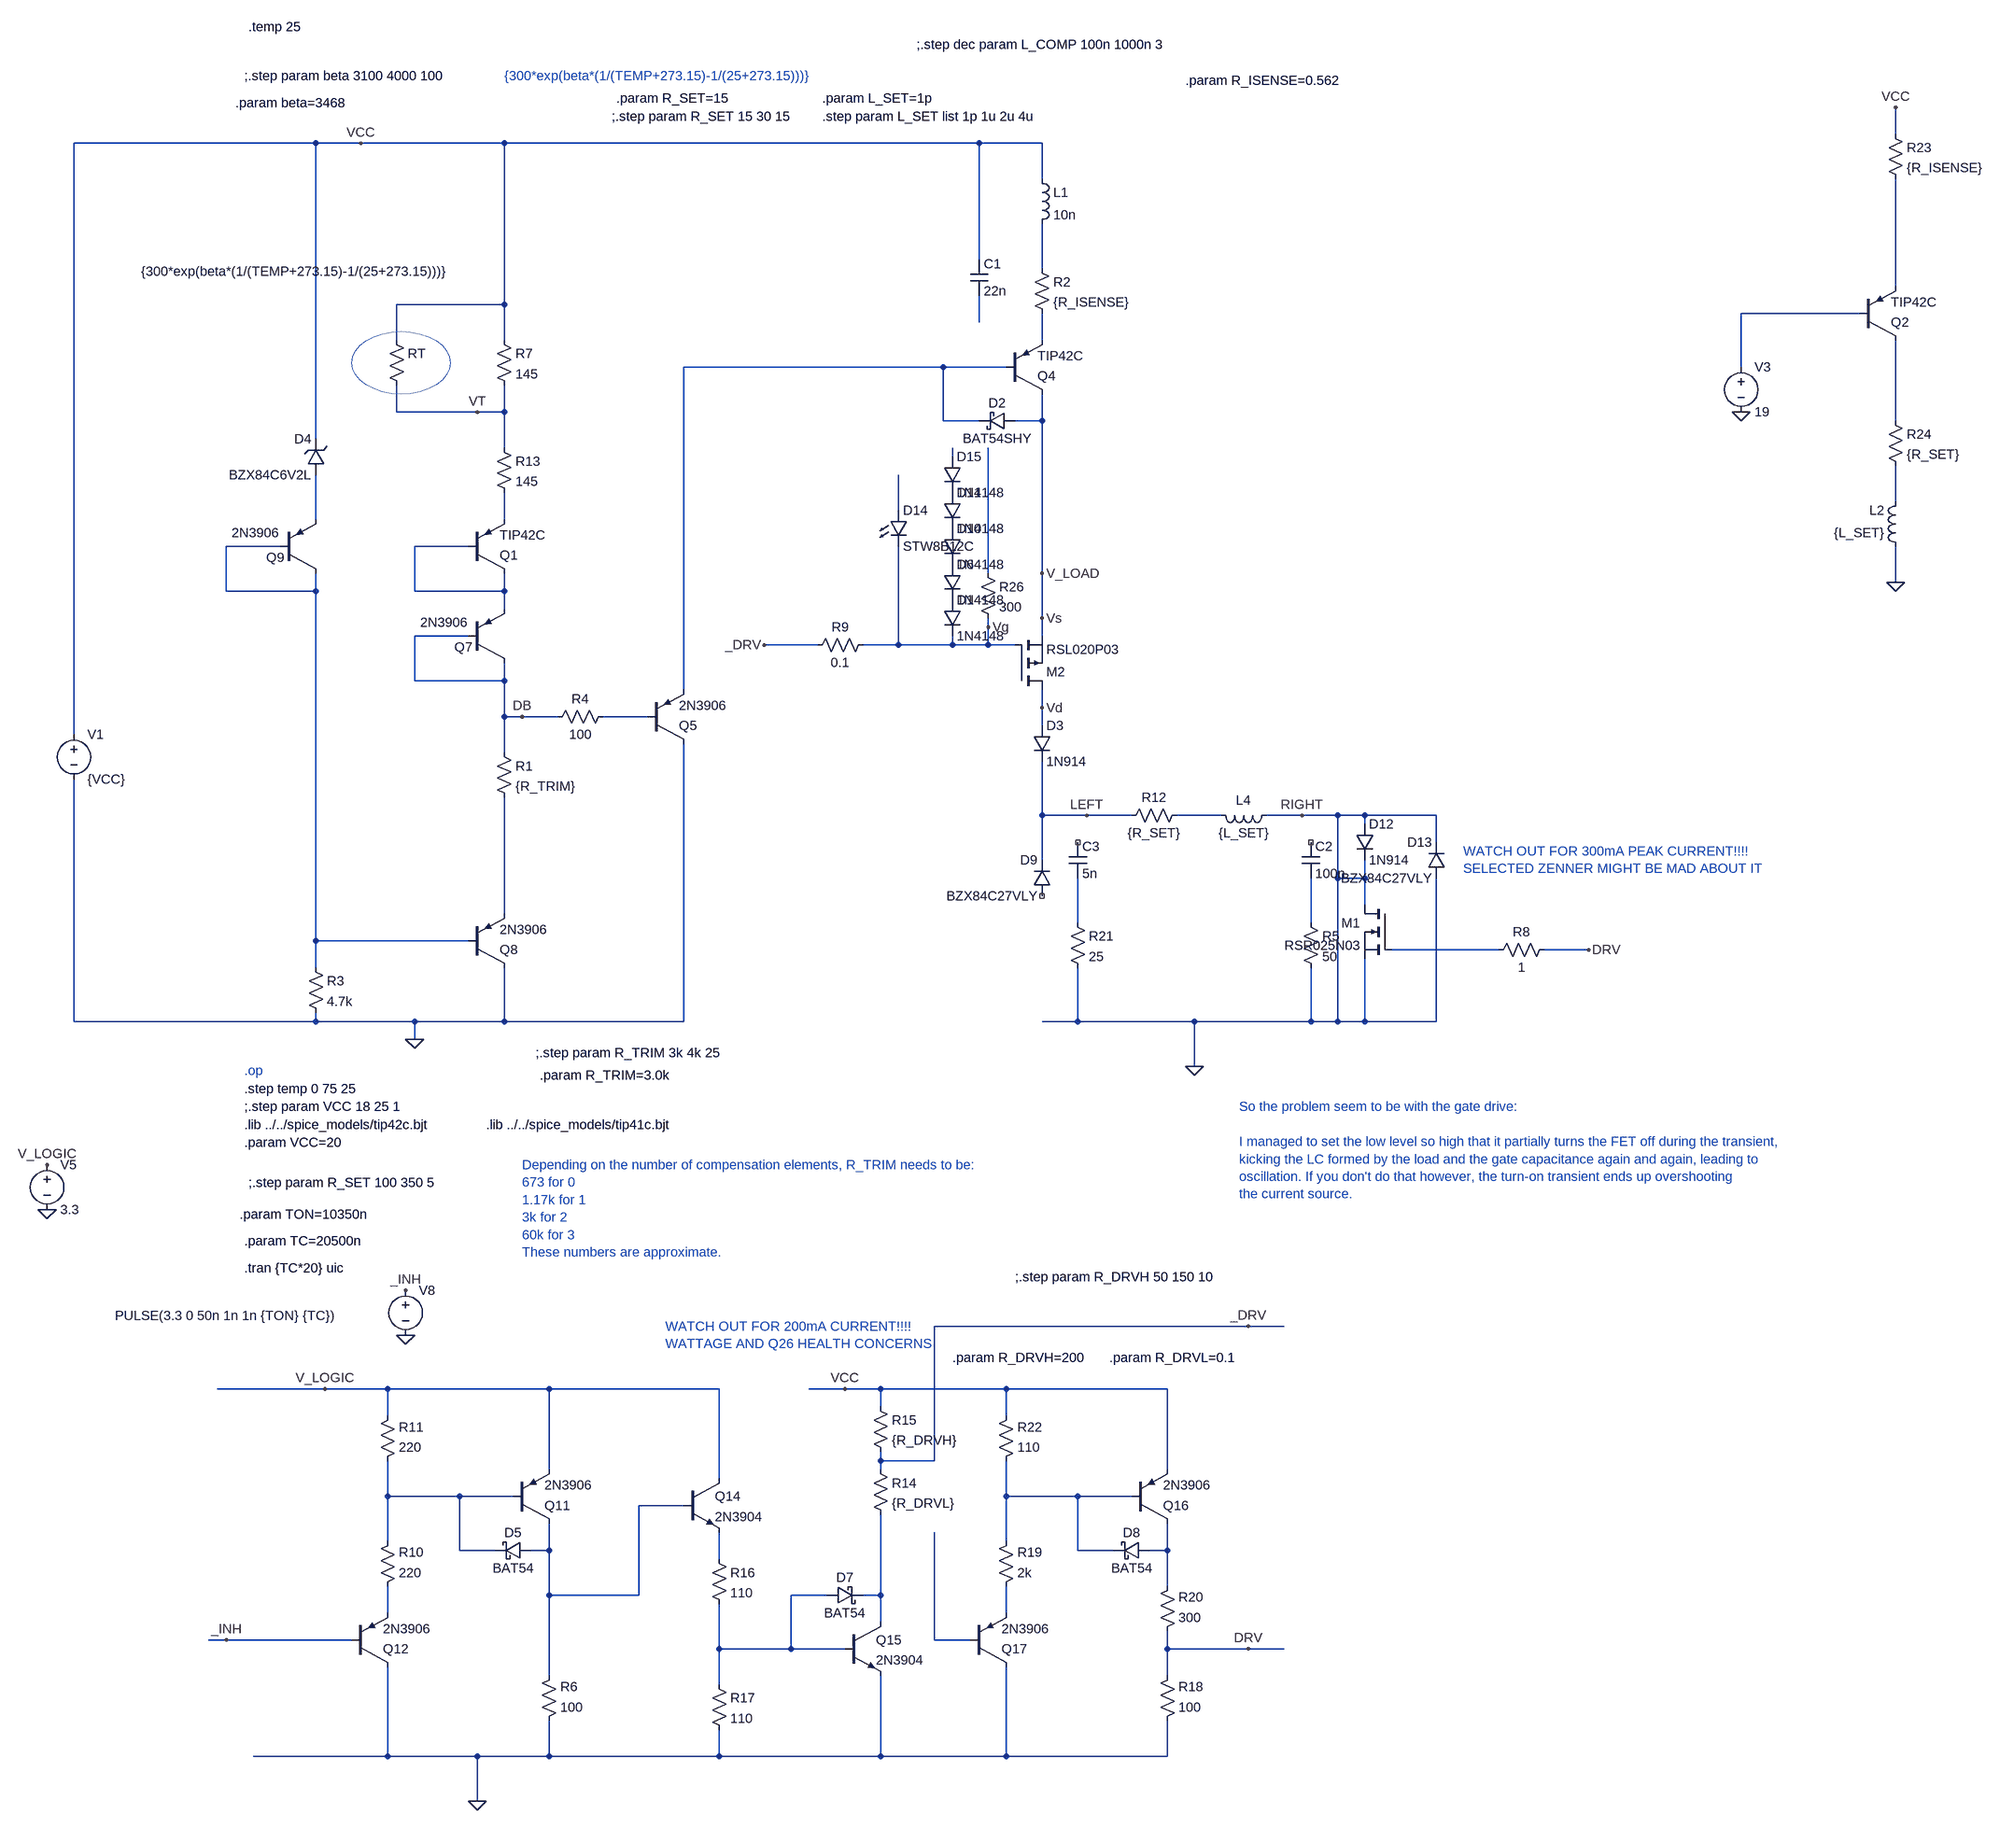
[diagram p0: schematic sense_inhibit4.asc]
sense_inhibit4.asc, the LTspice schematic file:
Version 4
SHEET 1 4220 5156
WIRE 352 -1568 352 -1616
WIRE -2496 -1552 -2928 -1552
WIRE -2416 -1552 -2496 -1552
WIRE -2160 -1552 -2416 -1552
WIRE -1312 -1552 -2160 -1552
WIRE -1200 -1552 -1312 -1552
WIRE -1200 -1488 -1200 -1552
WIRE -1312 -1344 -1312 -1552
WIRE -1200 -1328 -1200 -1408
WIRE 352 -1296 352 -1488
WIRE -2160 -1264 -2160 -1552
WIRE -2160 -1264 -2352 -1264
WIRE 288 -1248 48 -1248
WIRE -1312 -1232 -1312 -1280
WIRE -2352 -1200 -2352 -1264
WIRE -2160 -1200 -2160 -1264
WIRE -1200 -1200 -1200 -1248
WIRE -1376 -1152 -1840 -1152
WIRE -1264 -1152 -1376 -1152
WIRE 48 -1152 48 -1248
WIRE -2352 -1072 -2352 -1120
WIRE -2208 -1072 -2352 -1072
WIRE -2160 -1072 -2160 -1120
WIRE -2160 -1072 -2208 -1072
WIRE -1376 -1056 -1376 -1152
WIRE -1312 -1056 -1376 -1056
WIRE -1200 -1056 -1200 -1104
WIRE -1200 -1056 -1248 -1056
WIRE 352 -1056 352 -1200
WIRE -2496 -1024 -2496 -1552
WIRE -2160 -1008 -2160 -1072
WIRE -1360 -992 -1360 -1008
WIRE 352 -912 352 -976
WIRE -1456 -896 -1456 -960
WIRE -2496 -880 -2496 -960
WIRE -2160 -880 -2160 -928
WIRE -2560 -832 -2656 -832
WIRE -2224 -832 -2320 -832
WIRE -1296 -784 -1296 -1008
WIRE -1200 -784 -1200 -1056
WIRE 352 -768 352 -832
WIRE -2656 -752 -2656 -832
WIRE -2496 -752 -2496 -784
WIRE -2496 -752 -2656 -752
WIRE -2320 -752 -2320 -832
WIRE -2160 -752 -2160 -784
WIRE -2160 -752 -2320 -752
WIRE -2160 -720 -2160 -752
WIRE -1200 -704 -1200 -784
WIRE -1296 -688 -1296 -704
WIRE -2224 -672 -2320 -672
WIRE -1200 -672 -1200 -704
WIRE -1600 -656 -1696 -656
WIRE -1456 -656 -1456 -832
WIRE -1456 -656 -1520 -656
WIRE -1360 -656 -1360 -672
WIRE -1360 -656 -1456 -656
WIRE -1296 -656 -1296 -688
WIRE -1296 -656 -1360 -656
WIRE -1248 -656 -1296 -656
WIRE -2320 -592 -2320 -672
WIRE -2160 -592 -2160 -624
WIRE -2160 -592 -2320 -592
WIRE -1840 -576 -1840 -1152
WIRE -1200 -544 -1200 -576
WIRE -2160 -528 -2160 -592
WIRE -2128 -528 -2160 -528
WIRE -2064 -528 -2128 -528
WIRE -1904 -528 -1984 -528
WIRE -1200 -512 -1200 -544
WIRE -2928 -496 -2928 -1552
WIRE -2160 -464 -2160 -528
WIRE -1200 -352 -1200 -448
WIRE -1120 -352 -1200 -352
WIRE -1040 -352 -1120 -352
WIRE -880 -352 -960 -352
WIRE -736 -352 -800 -352
WIRE -672 -352 -736 -352
WIRE -624 -352 -672 -352
WIRE -496 -352 -624 -352
WIRE -624 -336 -624 -352
WIRE -496 -304 -496 -352
WIRE -1200 -272 -1200 -352
WIRE -672 -240 -672 -352
WIRE -624 -240 -624 -272
WIRE -624 -240 -672 -240
WIRE -624 -192 -624 -240
WIRE -2160 -176 -2160 -384
WIRE -1136 -160 -1136 -240
WIRE -720 -160 -720 -240
WIRE -2496 -128 -2496 -752
WIRE -2224 -128 -2496 -128
WIRE -384 -112 -576 -112
WIRE -224 -112 -304 -112
WIRE -2496 -80 -2496 -128
WIRE -2928 16 -2928 -416
WIRE -2496 16 -2496 0
WIRE -2496 16 -2928 16
WIRE -2320 16 -2496 16
WIRE -2160 16 -2160 -80
WIRE -2160 16 -2320 16
WIRE -1840 16 -1840 -480
WIRE -1840 16 -2160 16
WIRE -1136 16 -1136 -80
WIRE -1136 16 -1200 16
WIRE -928 16 -1136 16
WIRE -720 16 -720 -80
WIRE -720 16 -928 16
WIRE -672 16 -672 -240
WIRE -672 16 -720 16
WIRE -624 16 -624 -96
WIRE -624 16 -672 16
WIRE -496 16 -496 -240
WIRE -496 16 -624 16
WIRE -2320 48 -2320 16
WIRE -928 96 -928 16
WIRE -832 560 -1392 560
WIRE -768 560 -832 560
WIRE -2480 672 -2672 672
WIRE -2368 672 -2480 672
WIRE -2080 672 -2368 672
WIRE -1776 672 -2080 672
WIRE -1552 672 -1616 672
WIRE -1488 672 -1552 672
WIRE -1264 672 -1488 672
WIRE -976 672 -1264 672
WIRE -1488 704 -1488 672
WIRE -2368 720 -2368 672
WIRE -1264 720 -1264 672
WIRE -1488 800 -1488 784
WIRE -1392 800 -1392 560
WIRE -1392 800 -1488 800
WIRE -2080 816 -2080 672
WIRE -1488 816 -1488 800
WIRE -976 816 -976 672
WIRE -1776 832 -1776 672
WIRE -2368 864 -2368 800
WIRE -2240 864 -2368 864
WIRE -2144 864 -2240 864
WIRE -1264 864 -1264 800
WIRE -1136 864 -1264 864
WIRE -1040 864 -1136 864
WIRE -1840 880 -1920 880
WIRE -2368 944 -2368 864
WIRE -1264 944 -1264 864
WIRE -2240 960 -2240 864
WIRE -2176 960 -2240 960
WIRE -2080 960 -2080 912
WIRE -2080 960 -2112 960
WIRE -1136 960 -1136 864
WIRE -1072 960 -1136 960
WIRE -976 960 -976 912
WIRE -976 960 -1008 960
WIRE -1776 976 -1776 928
WIRE -976 1024 -976 960
WIRE -2080 1040 -2080 960
WIRE -1920 1040 -1920 880
WIRE -1920 1040 -2080 1040
WIRE -1584 1040 -1648 1040
WIRE -1488 1040 -1488 896
WIRE -1488 1040 -1520 1040
WIRE -2368 1072 -2368 1024
WIRE -1264 1072 -1264 1024
WIRE -1488 1088 -1488 1040
WIRE -2656 1120 -2688 1120
WIRE -2432 1120 -2656 1120
WIRE -1392 1120 -1392 928
WIRE -1328 1120 -1392 1120
WIRE -1776 1136 -1776 1056
WIRE -1648 1136 -1648 1040
WIRE -1648 1136 -1776 1136
WIRE -1552 1136 -1648 1136
WIRE -976 1136 -976 1104
WIRE -832 1136 -976 1136
WIRE -768 1136 -832 1136
WIRE -2080 1184 -2080 1040
WIRE -976 1184 -976 1136
WIRE -1776 1200 -1776 1136
WIRE -2368 1328 -2368 1168
WIRE -2368 1328 -2608 1328
WIRE -2208 1328 -2368 1328
WIRE -2080 1328 -2080 1264
WIRE -2080 1328 -2208 1328
WIRE -1776 1328 -1776 1280
WIRE -1776 1328 -2080 1328
WIRE -1488 1328 -1488 1184
WIRE -1488 1328 -1776 1328
WIRE -1264 1328 -1264 1168
WIRE -1264 1328 -1488 1328
WIRE -976 1328 -976 1264
WIRE -976 1328 -1264 1328
WIRE -2208 1408 -2208 1328
FLAG -2320 48 0
FLAG -2208 -1072 VT
FLAG -2416 -1552 VCC
FLAG -2128 -528 DB
FLAG -928 96 0
FLAG -2976 352 0
FLAG -2976 272 V_LOGIC
FLAG -2336 496 _INH
FLAG -2336 576 0
FLAG -1696 -656 _DRV
FLAG -1120 -352 LEFT
FLAG -736 -352 RIGHT
FLAG -1200 -784 V_LOAD
FLAG -2656 1120 _INH
FLAG -2480 672 V_LOGIC
FLAG -1552 672 VCC
FLAG -2208 1408 0
FLAG -832 560 _DRV
FLAG -832 1136 DRV
FLAG -224 -112 DRV
FLAG 352 -768 0
FLAG 48 -1072 0
FLAG 352 -1616 VCC
FLAG -1200 -544 Vd
FLAG -1296 -688 Vg
FLAG -1200 -704 Vs
SYMBOL res -2176 -480 R0
SYMATTR InstName R1
SYMATTR Value {R_TRIM}
SYMBOL res -1216 -1344 R0
SYMATTR InstName R2
SYMATTR Value {R_ISENSE}
SYMBOL voltage -2928 -512 R0
SYMATTR InstName V1
SYMATTR Value {VCC}
SYMBOL pnp -1264 -1104 M180
SYMATTR InstName Q4
SYMATTR Value TIP42C
SYMBOL pnp -1904 -480 M180
SYMATTR InstName Q5
SYMATTR Value 2N3906
SYMBOL pnp -2224 -624 M180
WINDOW 0 -25 28 Left 2
WINDOW 3 -86 72 Left 2
SYMATTR InstName Q7
SYMATTR Value 2N3906
SYMBOL res -2176 -1216 R0
SYMATTR InstName R7
SYMATTR Value 145
SYMBOL res -2176 -1024 R0
SYMATTR InstName R13
SYMATTR Value 145
SYMBOL res -2368 -1216 R0
WINDOW 3 -440 -107 Left 2
SYMATTR Value {300*exp(beta*(1/(TEMP+273.15)-1/(25+273.15)))}
SYMATTR InstName RT
SYMBOL schottky -1248 -1072 R90
WINDOW 0 0 32 VBottom 2
WINDOW 3 32 32 VTop 2
SYMATTR InstName D2
SYMATTR Value BAT54SHY
SYMATTR Description Diode
SYMATTR Type diode
SYMBOL res -1056 -336 R270
WINDOW 0 32 56 VTop 2
WINDOW 3 0 56 VBottom 2
SYMATTR InstName R12
SYMATTR Value {R_SET}
SYMBOL ind -784 -368 R90
WINDOW 0 5 56 VBottom 2
WINDOW 3 32 56 VTop 2
SYMATTR InstName L4
SYMATTR Value {L_SET}
SYMBOL voltage -2976 256 R0
SYMATTR InstName V5
SYMATTR Value 3.3
SYMBOL voltage -2336 480 R0
WINDOW 123 0 0 Left 0
WINDOW 39 0 0 Left 0
WINDOW 3 -519 61 Left 2
SYMATTR Value PULSE(3.3 0 50n 1n 1n {TON} {TC})
SYMATTR InstName V8
SYMBOL pmos -1248 -576 M180
SYMATTR InstName M2
SYMATTR Value RSL020P03
SYMBOL cap -1328 -1344 R0
SYMATTR InstName C1
SYMATTR Value 22n
SYMBOL diode -1216 -512 R0
SYMATTR InstName D3
SYMATTR Value 1N914
SYMBOL diode -1184 -208 R180
WINDOW 0 24 64 Left 2
WINDOW 3 24 0 Left 2
SYMATTR InstName D9
SYMATTR Value BZX84C27VLY
SYMBOL schottky -2112 976 M270
WINDOW 0 32 32 VTop 2
WINDOW 3 0 32 VBottom 2
SYMATTR InstName D5
SYMATTR Value BAT54
SYMATTR Description Diode
SYMATTR Type diode
SYMBOL res -2096 1280 M180
WINDOW 0 36 76 Left 2
WINDOW 3 36 40 Left 2
SYMATTR InstName R6
SYMATTR Value 100
SYMBOL res -2384 1040 M180
WINDOW 0 36 76 Left 2
WINDOW 3 36 40 Left 2
SYMATTR InstName R10
SYMATTR Value 220
SYMBOL res -2384 816 M180
WINDOW 0 36 76 Left 2
WINDOW 3 36 40 Left 2
SYMATTR InstName R11
SYMATTR Value 220
SYMBOL pnp -2144 912 M180
SYMATTR InstName Q11
SYMATTR Value 2N3906
SYMBOL pnp -2432 1168 M180
SYMATTR InstName Q12
SYMATTR Value 2N3906
SYMBOL schottky -1584 1024 M90
WINDOW 0 0 32 VBottom 2
WINDOW 3 32 32 VTop 2
SYMATTR InstName D7
SYMATTR Value BAT54
SYMATTR Description Diode
SYMATTR Type diode
SYMBOL res -1504 688 R0
SYMATTR InstName R15
SYMATTR Value {R_DRVH}
SYMBOL res -1792 960 R0
SYMATTR InstName R16
SYMATTR Value 110
SYMBOL res -1792 1184 R0
SYMATTR InstName R17
SYMATTR Value 110
SYMBOL npn -1840 832 R0
SYMATTR InstName Q14
SYMATTR Value 2N3904
SYMBOL npn -1552 1088 R0
SYMATTR InstName Q15
SYMATTR Value 2N3904
SYMBOL schottky -1008 976 M270
WINDOW 0 32 32 VTop 2
WINDOW 3 0 32 VBottom 2
SYMATTR InstName D8
SYMATTR Value BAT54
SYMATTR Description Diode
SYMATTR Type diode
SYMBOL res -992 1280 M180
WINDOW 0 36 76 Left 2
WINDOW 3 36 40 Left 2
SYMATTR InstName R18
SYMATTR Value 100
SYMBOL res -1280 1040 M180
WINDOW 0 36 76 Left 2
WINDOW 3 36 40 Left 2
SYMATTR InstName R19
SYMATTR Value 2k
SYMBOL res -1280 816 M180
WINDOW 0 36 76 Left 2
WINDOW 3 36 40 Left 2
SYMATTR InstName R22
SYMATTR Value 110
SYMBOL pnp -1040 912 M180
SYMATTR InstName Q16
SYMATTR Value 2N3906
SYMBOL pnp -1328 1168 M180
SYMATTR InstName Q17
SYMATTR Value 2N3906
SYMBOL nmos -576 -192 M0
SYMATTR InstName M1
SYMATTR Value RSR025N03
SYMBOL diode -640 -336 R0
SYMATTR InstName D12
SYMATTR Value 1N914
SYMBOL diode -480 -240 R180
WINDOW 0 24 64 Left 2
WINDOW 3 24 0 Left 2
SYMATTR InstName D13
SYMATTR Value BZX84C27VLY
SYMBOL zener -2480 -960 R180
WINDOW 0 24 64 Left 2
WINDOW 3 24 0 Left 2
SYMATTR InstName D4
SYMATTR Value BZX84C6V2L
SYMBOL res -2512 -96 R0
SYMATTR InstName R3
SYMATTR Value 4.7k
SYMBOL pnp -2224 -80 M180
SYMATTR InstName Q8
SYMATTR Value 2N3906
SYMBOL pnp -2560 -784 M180
WINDOW 0 -25 28 Left 2
WINDOW 3 -86 72 Left 2
SYMATTR InstName Q9
SYMATTR Value 2N3906
SYMBOL res -1968 -544 R90
WINDOW 0 0 56 VBottom 2
WINDOW 3 32 56 VTop 2
SYMATTR InstName R4
SYMATTR Value 100
SYMBOL pnp -2224 -784 M180
SYMATTR InstName Q1
SYMATTR Value TIP42C
SYMBOL res -288 -128 R90
WINDOW 0 0 56 VBottom 2
WINDOW 3 32 56 VTop 2
SYMATTR InstName R8
SYMATTR Value 1
SYMBOL res -1504 -672 R90
WINDOW 0 0 56 VBottom 2
WINDOW 3 32 56 VTop 2
SYMATTR InstName R9
SYMATTR Value 0.1
SYMBOL res -1504 800 R0
SYMATTR InstName R14
SYMATTR Value {R_DRVL}
SYMBOL res -992 1120 M180
WINDOW 0 36 76 Left 2
WINDOW 3 36 40 Left 2
SYMATTR InstName R20
SYMATTR Value 300
SYMBOL cap -1152 -304 R0
SYMATTR InstName C3
SYMATTR Value 5n
SYMBOL res -1152 -176 R0
SYMATTR InstName R21
SYMATTR Value 25
SYMBOL cap -736 -304 R0
SYMATTR InstName C2
SYMATTR Value 100n
SYMBOL res -736 -176 R0
SYMATTR InstName R5
SYMATTR Value 50
SYMBOL res 336 -1584 R0
SYMATTR InstName R23
SYMATTR Value {R_ISENSE}
SYMBOL pnp 288 -1200 M180
SYMATTR InstName Q2
SYMATTR Value TIP42C
SYMBOL res 336 -1072 R0
SYMATTR InstName R24
SYMATTR Value {R_SET}
SYMBOL ind 368 -816 R180
WINDOW 0 36 80 Left 2
WINDOW 3 36 40 Left 2
SYMATTR InstName L2
SYMATTR Value {L_SET}
SYMBOL voltage 48 -1168 R0
SYMATTR InstName V3
SYMATTR Value 19
SYMBOL res -1312 -800 R0
SYMATTR InstName R26
SYMATTR Value 300
SYMBOL diode -1376 -736 R0
SYMATTR InstName D1
SYMATTR Value 1N4148
SYMATTR Description Zener Diode
SYMATTR Type zener
SYMBOL diode -1376 -800 R0
SYMATTR InstName D6
SYMATTR Value 1N4148
SYMATTR Description Zener Diode
SYMATTR Type zener
SYMBOL diode -1376 -864 R0
SYMATTR InstName D10
SYMATTR Value 1N4148
SYMATTR Description Zener Diode
SYMATTR Type zener
SYMBOL diode -1376 -928 R0
SYMATTR InstName D11
SYMATTR Value 1N4148
SYMATTR Description Zener Diode
SYMATTR Type zener
SYMBOL LED -1472 -896 R0
SYMATTR InstName D14
SYMATTR Value STW8B12C
SYMATTR Description Zener Diode
SYMATTR Type zener
SYMBOL ind -1216 -1504 R0
SYMATTR InstName L1
SYMATTR Value 10n
SYMBOL diode -1376 -992 R0
SYMATTR InstName D15
SYMATTR Value 1N4148
SYMATTR Description Zener Diode
SYMATTR Type zener
TEXT -2624 456 Left 2 !.tran {TC*20} uic
TEXT -2624 136 Left 2 !.step temp 0 75 25
TEXT -2624 104 Left 2 ;.op
TEXT -2624 168 Left 2 !;.step param VCC 18 25 1
TEXT -2624 200 Left 2 !.lib ../../spice_models/tip42c.bjt
TEXT -2624 232 Left 2 !.param VCC=20
TEXT -2616 304 Left 2 !;.step param R_SET 100 350 5
TEXT -2640 -1624 Left 2 !.param beta=3468
TEXT -2624 -1672 Left 2 !;.step param beta 3100 4000 100
TEXT -2160 -1672 Left 2 ;{300*exp(beta*(1/(TEMP+273.15)-1/(25+273.15)))}
TEXT -1968 -1600 Left 2 !;.step param R_SET 15 30 15
TEXT -2616 -1760 Left 2 !.temp 25
TEXT -1592 -1600 Left 2 !.step param L_SET list 1p 1u 2u 4u
TEXT -2192 200 Left 2 !.lib ../../spice_models/tip41c.bjt
TEXT -1592 -1632 Left 2 !.param L_SET=1p
TEXT -1960 -1632 Left 2 !.param R_SET=15
TEXT -2632 360 Left 2 !.param TON=10350n
TEXT -2624 408 Left 2 !.param TC=20500n
TEXT -944 -1664 Left 2 !.param R_ISENSE=0.562
TEXT -1872 560 Left 2 ;WATCH OUT FOR 200mA CURRENT!!!!\nWATTAGE AND Q26 HEALTH CONCERNS
TEXT -448 -288 Left 2 ;WATCH OUT FOR 300mA PEAK CURRENT!!!!\nSELECTED ZENNER MIGHT BE MAD ABOUT IT
TEXT -1424 -1728 Left 2 !;.step dec param L_COMP 100n 1000n 3
TEXT -2104 72 Left 2 !;.step param R_TRIM 3k 4k 25
TEXT -2096 112 Left 2 !.param R_TRIM=3.0k
TEXT -2128 272 Left 2 ;Depending on the number of compensation elements, R_TRIM needs to be:\n673 for 0\n1.17k for 1\n3k for 2\n60k for 3\nThese numbers are approximate.
TEXT -1360 616 Left 2 !.param R_DRVH=200
TEXT -1080 616 Left 2 !.param R_DRVL=0.1
TEXT -1248 472 Left 2 !;.step param R_DRVH 50 150 10
TEXT -848 168 Left 2 ;So the problem seem to be with the gate drive:\n \nI managed to set the low level so high that it partially turns the FET off during the transient,\nkicking the LC formed by the load and the gate capacitance again and again, leading to\noscillation. If you don't do that however, the turn-on transient ends up overshooting\nthe current source.
CIRCLE Normal -2256 -1104 -2432 -1216 2

The netlist it stands for:
* sense_inhibit4.asc
R1 DB N018 {R_TRIM}
R2 N001 N005 {R_ISENSE}
V1 VCC 0 {VCC}
Q4 Vs N006 N005 0 TIP42C
Q5 0 N016 N006 0 2N3906
Q7 DB DB N014 0 2N3906
R7 VCC VT 145
R13 VT N012 145
RT VCC VT {300*exp(beta*(1/(TEMP+273.15)-1/(25+273.15)))}
D2 Vs N006 BAT54SHY
R12 LEFT N017 {R_SET}
L4 0 N017 {L_SET}
V5 V_LOGIC 0 3.3
V8 _INH 0 PULSE(3.3 0 50n 1n 1n {TON} {TC})
M2 Vd Vg Vs Vs RSL020P03
C1 VCC N004 22n
D3 Vd LEFT 1N914
D9 NC_01 LEFT BZX84C27VLY
D5 N024 N022 BAT54
R6 0 N024 100
R10 N029 N022 220
R11 N022 V_LOGIC 220
Q11 N024 N022 V_LOGIC 0 2N3906
Q12 0 _INH N029 0 2N3906
D7 N027 N028 BAT54
R15 VCC _DRV {R_DRVH}
R16 N026 N027 110
R17 N027 0 110
Q14 V_LOGIC N024 N026 0 2N3904
Q15 N028 N027 0 0 2N3904
D8 N025 N023 BAT54
R18 0 DRV 100
R19 N030 N023 2k
R22 N023 VCC 110
Q16 N025 N023 VCC 0 2N3906
Q17 0 N031 N030 0 2N3906
M1 0 N021 0 0 RSR025N03
D12 0 0 1N914
D13 0 0 BZX84C27VLY
D4 N011 VCC BZX84C6V2L
R3 N013 0 4.7k
Q8 0 N013 N018 0 2N3906
Q9 N013 N013 N011 0 2N3906
R4 N016 DB 100
Q1 N014 N014 N012 0 TIP42C
R8 DRV N021 1
R9 Vg _DRV 0.1
R14 _DRV N028 {R_DRVL}
R20 DRV N025 300
C3 NC_02 N019 5n
R21 N019 0 25
C2 NC_03 N020 100n
R5 N020 0 50
R23 VCC N002 {R_ISENSE}
Q2 N007 N003 N002 0 TIP42C
R24 N007 N009 {R_SET}
L2 0 N009 {L_SET}
V3 N003 0 19
R26 N015 Vg 300
D1 P001 Vg 1N4148
D6 P002 P001 1N4148
D10 P003 P002 1N4148
D11 P004 P003 1N4148
D14 N010 Vg STW8B12C
L1 VCC N001 10n
D15 N008 P004 1N4148
.model D D
.lib standard.dio
.model NPN NPN
.model PNP PNP
.lib standard.bjt
.model NMOS NMOS
.model PMOS PMOS
.lib standard.mos
.tran {TC*20} uic
.step temp 0 75 25
* .op
;.step param VCC 18 25 1
.lib ../../spice_models/tip42c.bjt
.param VCC=20
;.step param R_SET 100 350 5
.param beta=3468
;.step param beta 3100 4000 100
* {300*exp(beta*(1/(TEMP+273.15)-1/(25+273.15)))}
;.step param R_SET 15 30 15
.temp 25
.step param L_SET list 1p 1u 2u 4u
.lib ../../spice_models/tip41c.bjt
.param L_SET=1p
.param R_SET=15
.param TON=10350n
.param TC=20500n
.param R_ISENSE=0.562
* WATCH OUT FOR 200mA CURRENT!!!!
* WATTAGE AND Q26 HEALTH CONCERNS
* WATCH OUT FOR 300mA PEAK CURRENT!!!!
* SELECTED ZENNER MIGHT BE MAD ABOUT IT
;.step dec param L_COMP 100n 1000n 3
;.step param R_TRIM 3k 4k 25
.param R_TRIM=3.0k
* Depending on the number of compensation elements, R_TRIM needs to be:
* 673 for 0
* 1.17k for 1
* 3k for 2
* 60k for 3
* These numbers are approximate.
.param R_DRVH=200
.param R_DRVL=0.1
;.step param R_DRVH 50 150 10
* So the problem seem to be with the gate drive:
* I managed to set the low level so high that it partially turns the FET off during the transient,
* kicking the LC formed by the load and the gate capacitance again and again, leading to
* oscillation. If you don't do that however, the turn-on transient ends up overshooting
* the current source.
.backanno
.end